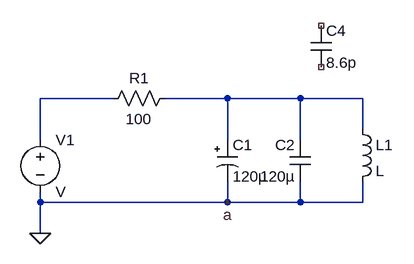
[diagram p0: schematic DESCRIPTION_POLARIZED_NOCAPACITOR_ERROR.asc]
DESCRIPTION_POLARIZED_NOCAPACITOR_ERROR.asc, the LTspice schematic file:
Version 4
SHEET 1 880 680
WIRE 160 96 48 96
WIRE 336 96 240 96
WIRE 448 96 336 96
WIRE 544 96 448 96
WIRE 544 144 544 96
WIRE 48 160 48 96
WIRE 336 160 336 96
WIRE 448 160 448 96
WIRE 48 256 48 240
WIRE 336 256 336 224
WIRE 336 256 48 256
WIRE 448 256 448 224
WIRE 448 256 336 256
WIRE 544 256 544 224
WIRE 544 256 448 256
WIRE 48 304 48 256
FLAG 48 304 0
FLAG 336 256 a
SYMBOL polcap 320 160 R0
SYMATTR InstName C1
SYMATTR Value 120µ
SYMATTR SpiceLine V=10 Irms=1.26 Rser=0.052 Lser=0 mfg="Chemi-Con" pn="LXF10VB122M10X30LL" type="Al electrolytic"
SYMBOL voltage 48 144 R0
SYMATTR InstName V1
SYMBOL res 256 80 R90
WINDOW 0 0 56 VBottom 2
WINDOW 3 32 56 VTop 2
SYMATTR InstName R1
SYMATTR Value 100
SYMBOL cap 464 224 R180
WINDOW 0 24 56 Left 2
WINDOW 3 24 8 Left 2
SYMATTR InstName C2
SYMATTR Value 120µ
SYMATTR SpiceLine V=25 Irms=0 Rser=0 Lser=0 mfg="Murata" pn="GRM155R61E105MA12" type="X5R"
SYMBOL ind 528 128 R0
SYMATTR InstName L1
SYMBOL cap 464 -16 R0
WINDOW 3 24 57 Left 2
SYMATTR Value 8.6p
SYMATTR InstName C4
SYMATTR Description Polarized 
SYMATTR SpiceLine V=100 Irms=0 Rser=0 Lser=0 mfg="Murata" pn="GRM0335C2A8R6CA01" type="C0G"

The netlist it stands for:
* DESCRIPTION_POLARIZED_NOCAPACITOR_ERROR.asc
C1 N002 0 120µ V=10 Irms=1.26 Rser=0.052 Lser=0 mfg="Chemi-Con" pn="LXF10VB122M10X30LL" type="Al electrolytic"
V1 N001 0 V
R1 N002 N001 100
C2 0 N002 120µ V=25 Irms=0 Rser=0 Lser=0 mfg="Murata" pn="GRM155R61E105MA12" type="X5R"
L1 N002 0 L
C4 NC_01 NC_02 8.6p V=100 Irms=0 Rser=0 Lser=0 mfg="Murata" pn="GRM0335C2A8R6CA01" type="C0G"
.backanno
.end